# EAGLE design surplus_relay_hat_v2 (EAGLE 8.0.2)
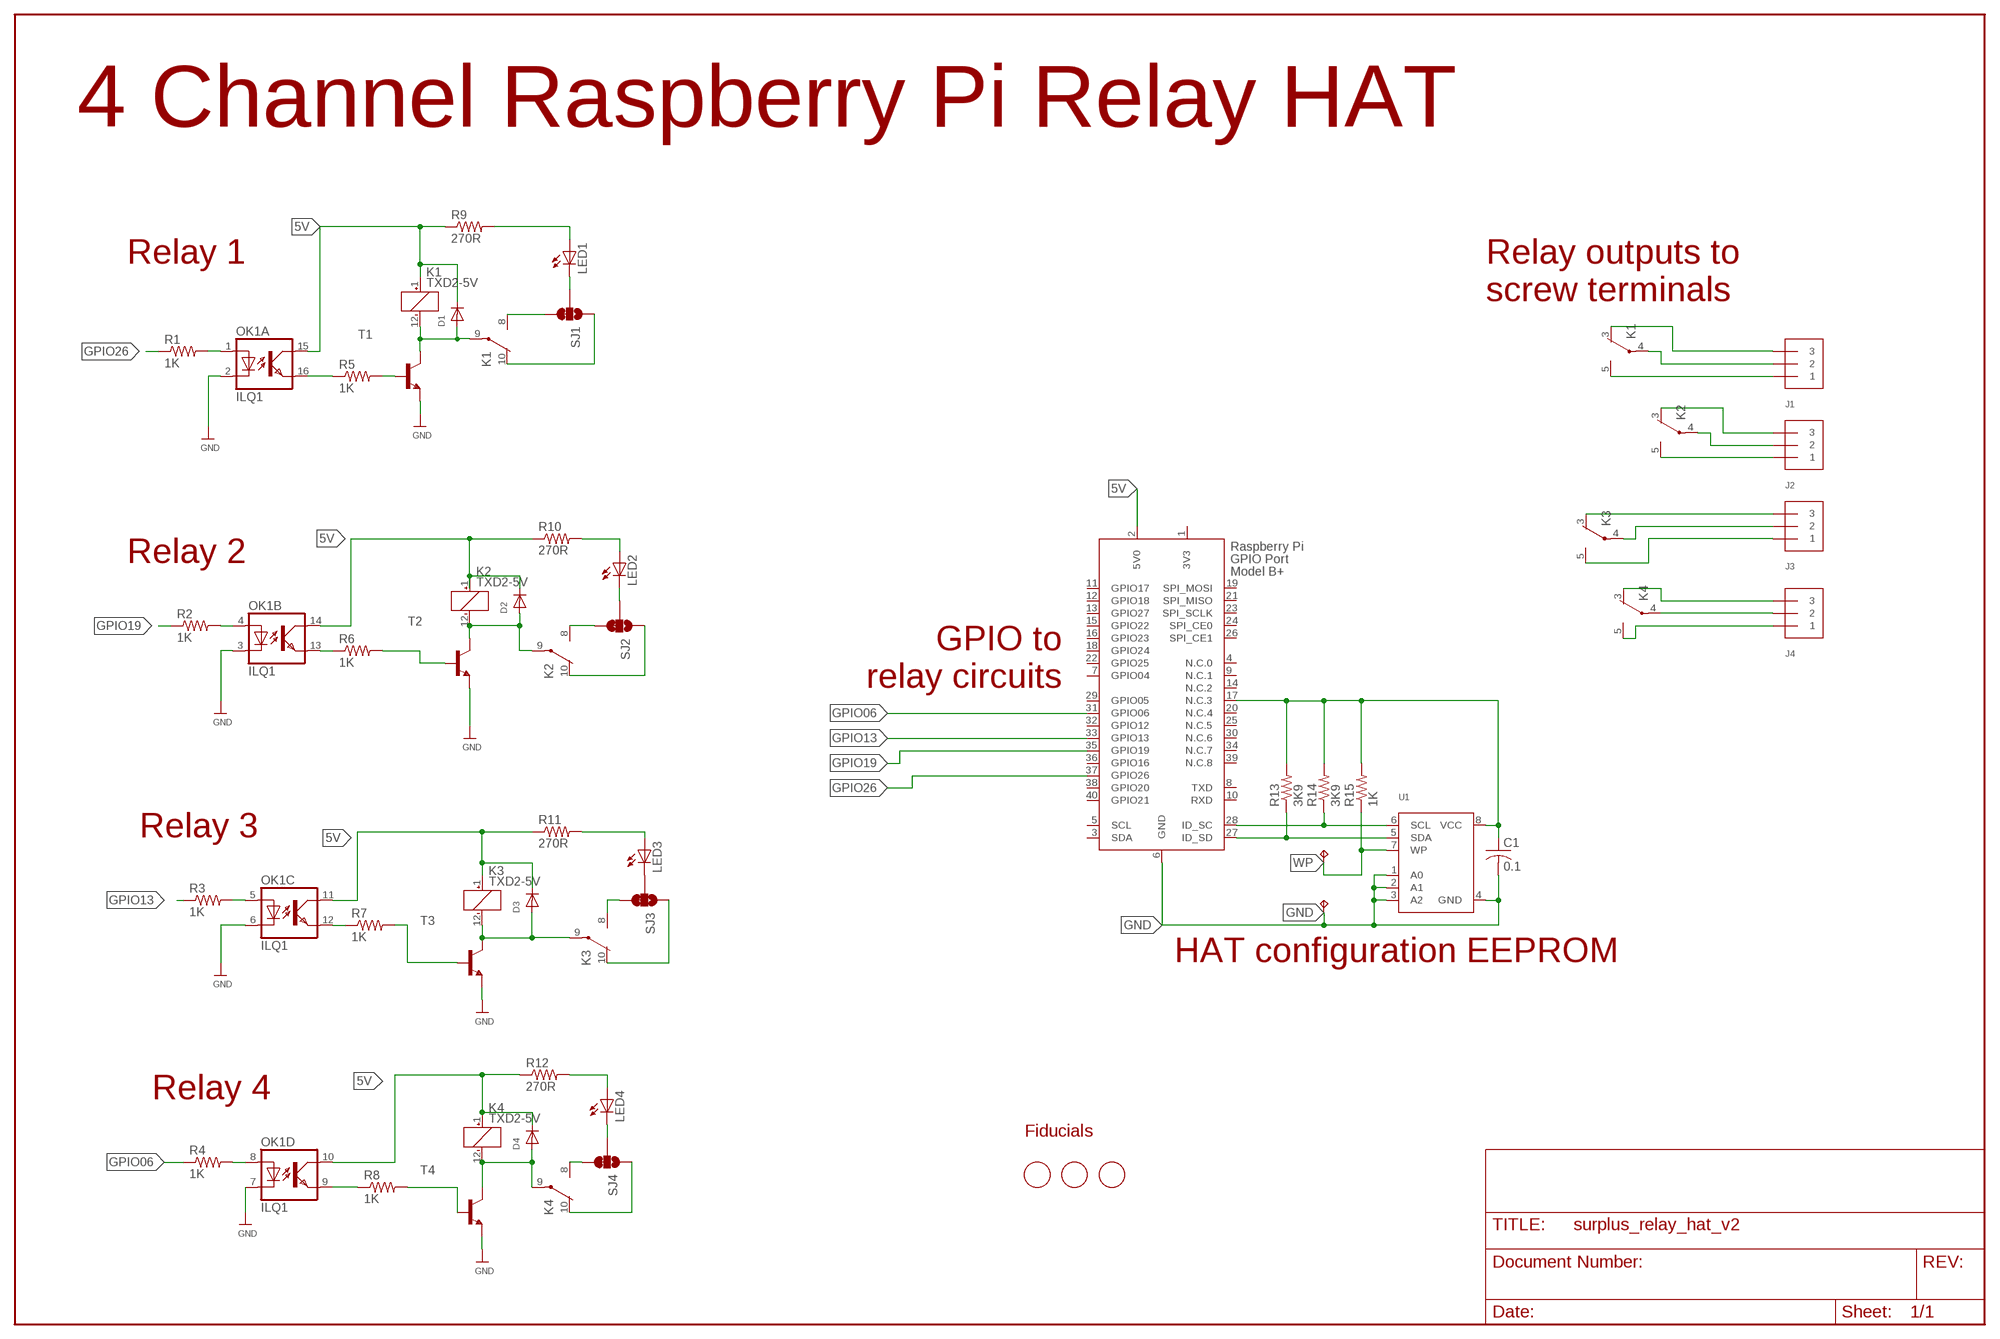
[diagram p0: schematic, sheet 1]

## Parts
C1  0.1  C-USC0805K  [C0805K]
CFG  TPTP11R  [TP11R]
D1  DIODE_SOD-123FL  [SOD-123FL]
D2  DIODE_SOD-123FL  [SOD-123FL]
D3  DIODE_SOD-123FL  [SOD-123FL]
D4  DIODE_SOD-123FL  [SOD-123FL]
GND  TPTP11R  [TP11R]
J1  TERMBLOCK_1X3  [TERMBLOCK_1X3-3.5MM]
J2  TERMBLOCK_1X3  [TERMBLOCK_1X3-3.5MM]
J3  TERMBLOCK_1X3  [TERMBLOCK_1X3-3.5MM]
J4  TERMBLOCK_1X3  [TERMBLOCK_1X3-3.5MM]
K1  TXD2-5V  [TXD2]
K2  TXD2-5V  [TXD2]
K3  TXD2-5V  [TXD2]
K4  TXD2-5V  [TXD2]
LED1  LEDCHIP-LED0805  [CHIP-LED0805]
LED2  LEDCHIP-LED0805  [CHIP-LED0805]
LED3  LEDCHIP-LED0805  [CHIP-LED0805]
LED4  LEDCHIP-LED0805  [CHIP-LED0805]
OK1  ILQ1  [DIL16]
R1  1K  R-US_R0603  [R0603]
R2  1K  R-US_R0603  [R0603]
R3  1K  R-US_R0603  [R0603]
R4  1K  R-US_R0603  [R0603]
R5  1K  R-US_R0603  [R0603]
R6  1K  R-US_R0603  [R0603]
R7  1K  R-US_R0603  [R0603]
R8  1K  R-US_R0603  [R0603]
R9  270R  R-US_R0603  [R0603]
R10  270R  R-US_R0603  [R0603]
R11  270R  R-US_R0603  [R0603]
R12  270R  R-US_R0603  [R0603]
R13  3K9  R-US_R0603  [R0603]
R14  3K9  R-US_R0603  [R0603]
R15  1K  R-US_R0603  [R0603]
SJ1  JUMPER-PAD-3-2OF3_NC_BY_TRACE  [PAD-JUMPER-3-2OF3_NC_BY_TRACE_YES_SILK_FULL_BOX]
SJ2  JUMPER-PAD-3-2OF3_NC_BY_TRACE  [PAD-JUMPER-3-2OF3_NC_BY_TRACE_YES_SILK_FULL_BOX]
SJ3  JUMPER-PAD-3-2OF3_NC_BY_TRACE  [PAD-JUMPER-3-2OF3_NC_BY_TRACE_YES_SILK_FULL_BOX]
SJ4  JUMPER-PAD-3-2OF3_NC_BY_TRACE  [PAD-JUMPER-3-2OF3_NC_BY_TRACE_YES_SILK_FULL_BOX]
T1  MMBT2222ALT1-NPN-SOT23-BEC  [SOT23-BEC]
T2  MMBT2222ALT1-NPN-SOT23-BEC  [SOT23-BEC]
T3  MMBT2222ALT1-NPN-SOT23-BEC  [SOT23-BEC]
T4  MMBT2222ALT1-NPN-SOT23-BEC  [SOT23-BEC]
U1  EEPROM_I2C_SOIC8_GENERIC  [SOIC8_150MIL]
U$2  FIDUCIAL  [FIDUCIAL_1MM]
U$12  FIDUCIAL  [FIDUCIAL_1MM]
U$13  FIDUCIAL  [FIDUCIAL_1MM]
X1  RASPI_BOARD_B+_H  [RASPI_BOARD_B+HAT]

## Nets
5V: D1.C D2.C D3.C D4.C K1.1(_:+) K2.1(_:+) K3.1(_:+) K4.1(_:+) OK1.10(D:COL) OK1.11(C:COL) OK1.14(B:COL) OK1.15(A:COL) R9.1 R10.1 R11.1 R12.1 X1.2(5V0)
GND: C1.2 GND.TP OK1.2(A:C) OK1.3(B:C) OK1.6(C:C) OK1.7(D:C) T1.E T2.E T3.E T4.E U1.1(A0) U1.2(A1) U1.3(A2) U1.4(GND) X1.6(GND)
GPIO06: R4.1 X1.31(GPIO06)
GPIO13: R3.1 X1.33(GPIO13)
GPIO19: R2.1 X1.35(GPIO19)
GPIO26: R1.1 X1.37(GPIO26)
ID-SCL: R14.1 U1.6(SCL) X1.28(ID_SC)
ID-SDA: R13.1 U1.5(SDA) X1.27(ID_SD)
N$1: R5.2 T1.B
N$2: OK1.16(A:EMIT) R5.1
N$3: OK1.1(A:A) R1.2
N$4: D1.A K1.9(P) K1.12(_:-) T1.C
N$5: J1.2 K1.4(P)
N$6: J1.1 K1.5(S)
N$7: J1.3 K1.3(O)
N$8: J2.1 K2.5(S)
N$9: OK1.4(B:A) R2.2
N$10: D2.A K2.9(P) K2.12(_:-) T2.C
N$11: R6.2 T2.B
N$12: J2.2 K2.4(P)
N$13: OK1.12(C:EMIT) R7.1
N$14: J2.3 K2.3(O)
N$15: OK1.5(C:A) R3.2
N$16: OK1.8(D:A) R4.2
N$17: D4.A K4.9(P) K4.12(_:-) T4.C
N$18: R7.2 T3.B
N$19: OK1.9(D:EMIT) R8.1
N$20: LED1.C SJ1.2
N$21: J3.2 K3.4(P)
N$22: J3.1 K3.5(S)
N$23: J3.3 K3.3(O)
N$24: R8.2 T4.B
N$25: K1.8(S) SJ1.3
N$26: J4.1 K4.5(S)
N$27: J4.2 K4.4(P)
N$28: J4.3 K4.3(O)
N$29: LED1.A R9.2
N$30: K1.10(O) SJ1.1
N$32: K4.10(O) SJ4.1
N$33: LED4.A R12.2
N$34: LED3.A R11.2
N$35: K4.8(S) SJ4.3
N$36: LED4.C SJ4.2
N$37: LED2.A R10.2
N$39: C1.1 R13.2 R14.2 R15.2 U1.8(VCC) X1.17(N.C.3)
N$40: OK1.13(B:EMIT) R6.1
N$42: D3.A K3.9(P) K3.12(_:-) T3.C
N$43: K3.8(S) SJ3.3
N$44: K3.10(O) SJ3.1
N$45: LED3.C SJ3.2
N$46: LED2.C SJ2.2
N$47: K2.8(S) SJ2.3
N$48: K2.10(O) SJ2.1
WP: CFG.TP R15.1 U1.7(WP)
Unconnected: X1.3(SDA) X1.4(N.C.0) X1.5(SCL) X1.7(GPIO04) X1.8(TXD) X1.10(RXD) X1.11(GPIO17) X1.12(GPIO18) X1.13(GPIO27) X1.14(N.C.2) X1.15(GPIO22) X1.16(GPIO23) X1.18(GPIO24) X1.19(SPI_MOSI) X1.20(N.C.4) X1.21(SPI_MISO) X1.22(GPIO25) X1.23(SPI_SCLK) X1.24(SPI_CE0) X1.25(N.C.5) X1.26(SPI_CE1) X1.29(GPIO05) X1.30(N.C.6) X1.32(GPIO12) X1.34(N.C.7) X1.36(GPIO16) X1.38(GPIO20) X1.39(N.C.8) X1.40(GPIO21)

## Notes on the sheet
- 4 Channel Raspberry Pi Relay HAT
- Relay 1
- Relay outputs to
  screw terminals
- Relay 2
- GPIO to
  relay circuits
- Relay 3
- HAT configuration EEPROM
- Relay 4
- Fiducials

## Power pins joined to a net without a drawn wire
3V3: X1.1(3V3)
N.C.1: X1.9(N.C.1)

## Library data of the parts
C1 = adafruit:C-US: CAPACITOR, American symbol
CFG GND = testpad:TP: Test pad
D1-D4 = adafruit:DIODE: Diode SMADIODE - SMA Surface Mount Package 20V 1A Schottky Diode Digikey: 641-1014-6-ND DO-1N4148 - Through Hole Small Current Diode SOD-123 20V 1 A (.5mV Vf) Schottky Diode - Digikey: MBRX120TPMSCT-ND SOD-323 10V 570mA (.38mV Vf, 3ns) Schottky Diode - Digikey: ZLLS410CT-ND SOD-523 30V 30mA Schottky Diode (RB751S-40TE61) - Digikey: RB751S-40TE61CT-ND SOT23-R/W - SOT23 Package (R = Solder Paste/Reflow Ovens, W = Hand-Soldering) BAT54Film 40V 300mA - Digikey: 497-7162-1-ND
J1-J4 = TL2575:TERMBLOCK_1X3: 3.5mm Terminal block http://www.ladyada.net/library/pcb/eaglelibrary.html
K1-K4 = relay:TX?-*: TX Relais NAiS TX-D RELAYS HIGH INSULATION Conforming to the supplementary insulation class of EN Standards (EN41003) Source: http://www.mew-europe.com/.. en_ds_61022_0007.pdf TX-S RELAYS SMALL POLARIZED RELAY WITH HIGH SENSITIVITY 50mW Source: http://www.mew-europe.com/.. en_ds_61022_0022.pdf; MPN: TXD2-5V; OC_FARNELL: unknown; OC_NEWARK: 13P9525
LED1-LED4 = adafruit:LED: LED OSRAM: - CHIPLED LG R971, LG N971, LY N971, LG Q971, LY Q971, LO R971, LY R971 LH N974, LH R974 LS Q976, LO Q976, LY Q976 LO Q996 - Hyper CHIPLED LW Q18S LB Q993, LB Q99A, LB R99A - SideLED LS A670, LO A670, LY A670, LG A670, LP A670 LB A673, LV A673, LT A673, LW A673 LH A674 LY A675 LS A676, LA A676, LO A676, LY A676, LW A676 LS A679, LY A679, LG A679 - Hyper Micro SIDELED® LS Y876, LA Y876, LO Y876, LY Y876 LT Y87S - SmartLED LW L88C, LW L88S LB L89C, LB L89S, LG L890 LS L89K, LO L89K, LY L89K LS L896, LA L896, LO L896, LY L896 - TOPLED LS T670, LO T670, LY T670, LG T670, LP T670 LSG T670, LSP T670, LSY T670, LOP T670, LYG T670 LG T671, LOG T671, LSG T671 LB T673, LV T673, LT T673, LW T673 LH T674 LS T676, LA T676, LO T676, LY T676, LB T676, LH T676, LSB T676, LW T676 LB T67C, LV T67C, LT T67C, LS T67K, LO T67K, LY T67K, LW E67C LS E67B, LA E67B, LO E67B, LY E67B, LB E67C, LV E67C, LT E67C LW T67C LS T679, LY T679, LG T679 LS T770, LO T770, LY T770, LG T770, LP T770 LB T773, LV T773, LT T773, LW T773 LH T774 LS E675, LA E675, LY E675, LS T675 LS T776, LA T776, LO T776, LY T776, LB T776 LHGB T686 LT T68C, LB T68C - Hyper Mini TOPLED® LB M676 - Mini TOPLED Santana® LG M470 LS M47K, LO M47K, LY M47K Source: http://www.osram.convergy.de/
OK1 = optocoupler:ILQ1: SIEMENS OPTO COUPLER; MF: VISHAY/TELEFUNKEN; MPN: ILQ1; OC_FARNELL: 1469501; OC_NEWARK: 88K1954
R1-R15 = adafruit:R-US_: RESISTOR, American symbol
SJ1-SJ4 = SparkFun-Passives:JUMPER-PAD-3-2OF3_NC_BY_TRACE
T1-T4 = transistor:*-NPN-: NPN Transistror BF959 corrected 2008.03.06
U1 = microbuilder:EEPROM_I2C_SOIC8_GENERIC
U$2 U$12 U$13 = adafruit:FIDUCIAL
X1 = raspberrypi_bastelstube_v13:RASPI_BOARD_B+

## Board
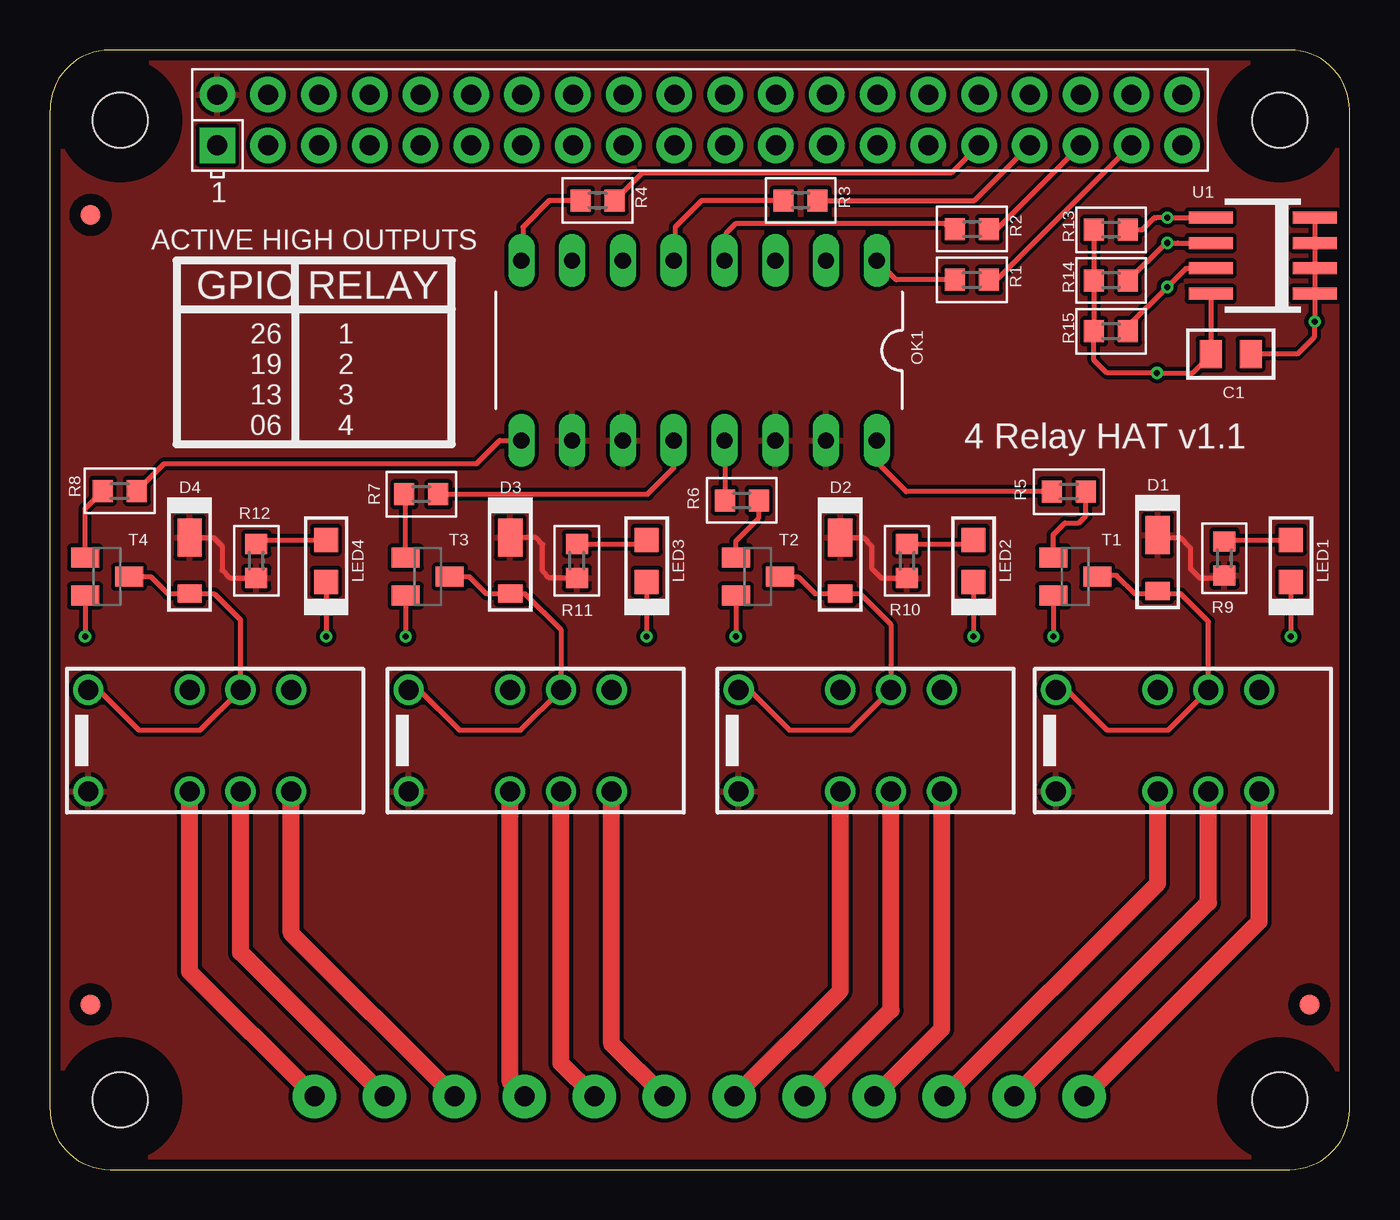
[diagram p1: board, top side]
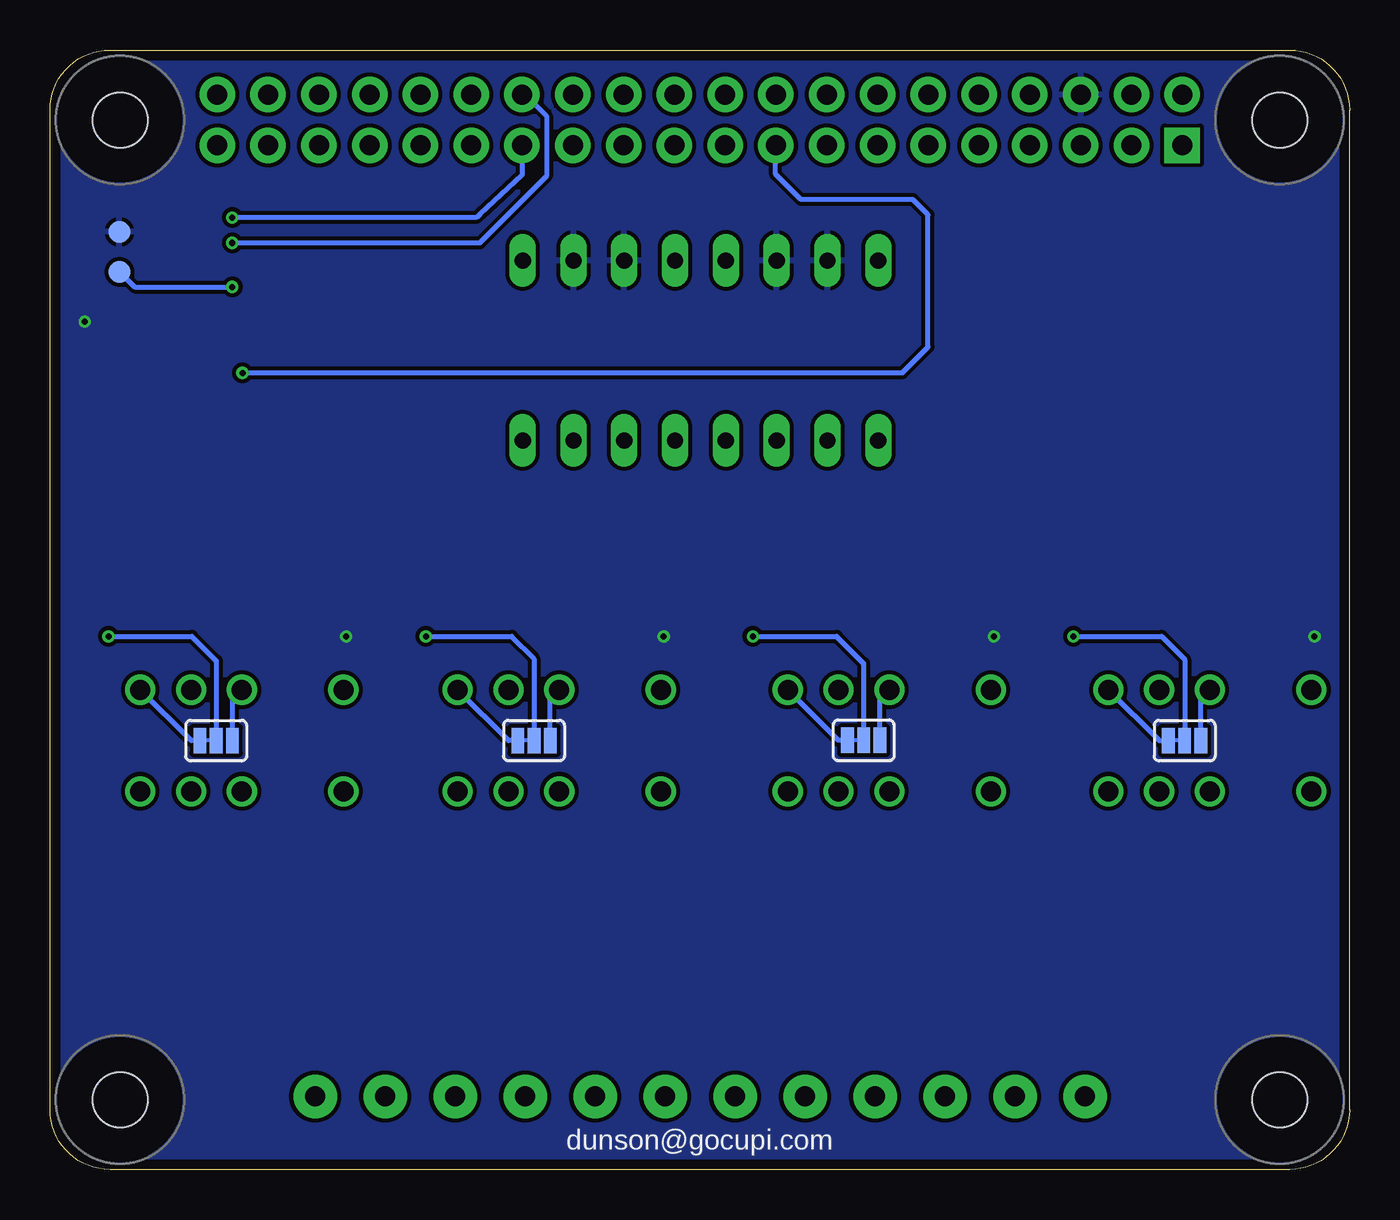
[diagram p2: board, bottom side, seen from below]

Size 65 x 56 mm. Coordinates in mm from the lower left corner, seen from the top.
Copper layers (1*16): Top 0.035mm / dielectric 1.5mm / Bottom 0.035mm
Design rules "dirt_cheap_dirty_boards.v1 *": minimum track width 5mil, minimum drill 12mil, track to track 8mil, track to pad 8mil, pad to pad 8mil, via to via 8mil, smd to smd 8mil, copper to edge 20mil, drill to drill 12mil, minimum pad ring 10mil, minimum via ring 6mil, stop-mask expansion 2mil, vias tented up to drill 25mil, thermal gap 8mil
tRestrict: area 0.4,0.4 to 6.6,6.6; area 58.4,0.4 to 64.6,6.6; area 0.4,49.4 to 6.6,55.6; area 58.4,49.4 to 64.6,55.6
bRestrict: area 0.4,0.4 to 6.6,6.6; area 58.4,0.4 to 64.6,6.6; area 0.4,49.4 to 6.6,55.6; area 58.4,49.4 to 64.6,55.6

### Footprints (pad centres in the part's own frame; a part is rotated, then mirrored left to right if it is on the bottom)
C0805K = smd 1.1 x 1.4: 1 -1,0; 2 1,0
TP11R = smd 1.1 x 1.1: TP 0,0
SOD-123FL = smd 0.91 x 1.22: A 1.637,0 | smd 1.91 x 1.22: C -1.161,0
TERMBLOCK_1X3-3.5MM = drill 1 pad 2.184: 1 3.55,0; 2 0.05,0; 3 -3.45,0
TXD2 = drill 1: 1 -6.35,-2.54; 3 -1.27,-2.54; 4 1.27,-2.54; 5 3.81,-2.54; 8 3.81,2.54; 9 1.27,2.54; 10 -1.27,2.54; 12 -6.35,2.54
CHIP-LED0805 = smd 1.2 x 1.2: A 0,-1.05; C 0,1.05
DIL16 = drill 0.813 long: 1 -8.89,-4.5; 2 -6.35,-4.5; 3 -3.81,-4.5; 4 -1.27,-4.5; 5 1.27,-4.5; 6 3.81,-4.5; 7 6.35,-4.5; 8 8.89,-4.5; 9 8.89,4.5; 10 6.35,4.5; 11 3.81,4.5; 12 1.27,4.5; 13 -1.27,4.5; 14 -3.81,4.5; 15 -6.35,4.5; 16 -8.89,4.5
R0603 = smd 1 x 1.1: 1 -0.85,0; 2 0.85,0
PAD-JUMPER-3-2OF3_NC_BY_TRACE_YES_SILK_FULL_BOX = smd 0.635 x 1.27: 1 -0.813,0; 2 0,0; 3 0.813,0
SOT23-BEC = smd 1 x 1.4: B -0.95,-1.1; C 0,1.1; E 0.95,-1.1
SOIC8_150MIL = smd 0.6 x 2.2: 1 -1.905,-2.6; 2 -0.635,-2.6; 3 0.635,-2.6; 4 1.905,-2.6; 5 1.905,2.6; 6 0.635,2.6; 7 -0.635,2.6; 8 -1.905,2.6
FIDUCIAL_1MM = smd 1 x 1: 1 0,0
RASPI_BOARD_B+HAT = drill 1 pad 1.778 square: 1 8.37,51.23 | drill 1 pad 1.778: 2 8.37,53.77; 3 10.91,51.23; 4 10.91,53.77; 5 13.45,51.23; 6 13.45,53.77; 7 15.99,51.23; 8 15.99,53.77; 9 18.53,51.23; 10 18.53,53.77; 11 21.07,51.23; 12 21.07,53.77; 13 23.61,51.23; 14 23.61,53.77; 15 26.15,51.23; 16 26.15,53.77; 17 28.69,51.23; 18 28.69,53.77; 19 31.23,51.23; 20 31.23,53.77; 21 33.77,51.23; 22 33.77,53.77; 23 36.31,51.23; 24 36.31,53.77; 25 38.85,51.23; 26 38.85,53.77; 27 41.39,51.23; 28 41.39,53.77; 29 43.93,51.23; 30 43.93,53.77; 31 46.47,51.23; 32 46.47,53.77; 33 49.01,51.23; 34 49.01,53.77; 35 51.55,51.23; 36 51.55,53.77; 37 54.09,51.23; 38 54.09,53.77; 39 56.63,51.23; 40 56.63,53.77 | hole 2.75: 3.5,3.5; 3.5,52.5; 61.5,3.5; 61.5,52.5

### Placement (x,y rotation side)
C1  59.05,40.79 0 top
CFG  61.53,44.91 270 bottom
D1  55.4,30.57 270 top
D2  39.53,30.45 270 top
D3  23.02,30.45 270 top
D4  6.99,30.45 270 top
GND  61.53,46.91 270 bottom
J1  48.18,3.65 0 top
J2  37.68,3.65 0 top
J3  27.18,3.65 0 top
J4  16.68,3.65 0 top
K1  56.67,21.46 0 top
K2  40.8,21.46 0 top
K3  24.29,21.46 0 top
K4  8.26,21.46 0 top
LED1  62.07,30.45 180 top
LED2  46.2,30.45 180 top
LED3  29.84,30.45 180 top
LED4  13.81,30.45 180 top
OK1  32.47,40.97 180 top
R1  46.11,44.5 180 top
R2  46.12,47.04 180 top
R3  37.55,48.47 180 top
R4  27.39,48.47 180 top
R5  50.96,33.91 0 top
R6  34.6,33.46 0 top
R7  18.57,33.78 180 top
R8  3.49,33.94 180 top
R9  58.74,30.57 90 top
R10  42.86,30.45 90 top
R11  26.35,30.45 90 top
R12  10.32,30.45 90 top
R13  53.07,47.01 180 top
R14  53.07,44.47 180 top
R15  53.07,41.93 180 top
SJ1  56.69,21.45 180 bottom
SJ2  40.79,21.46 180 bottom
SJ3  24.3,21.47 180 bottom
SJ4  8.25,21.45 180 bottom
T1  51.28,29.65 270 top
T2  35.4,29.65 270 top
T3  18.89,29.65 270 top
T4  2.86,29.65 270 top
U1  60.66,45.71 90 top
U$2  2.03,8.26 0 top
U$12  62.99,8.26 0 top
U$13  2.03,47.75 0 top
X1  0,0 0 top

### Tracks (layer width: path | path; a pad name or v marks a point on that pad's centre or on a via)
5V
  Top 0.254: R11.1 24.97,29.6 24.64,29.93 24.64,31.27 24.31,31.6 D3.C | D4.C 8.2,31.61 8.61,31.2 8.61,29.98 8.99,29.6 R12.1 | D2.C 40.69,31.61 41.1,31.2 41.1,30.08 41.58,29.6 R10.1 | R9.1 58.74,29.6 57.51,29.6 57.05,30.05 57.05,31.1 56.53,31.61 55.53,31.61 D1.C
  pour Top: 2.54,0 62.39,0 arc90 64.93,2.54 65,53 arc90 62,56.01 3.02,56.01 arc90 0.02,53.01 0,2.54 arc90
GND  (via drill 0.3)
  Top 0.254: T4.E 1.76,28.66 v1.75,26.67 | T3.E 17.79,28.66 v17.79,26.67 | T2.E v34.3,26.67 | T1.E 50.19,28.73 v50.19,26.67 | C1.2 62.38,40.79 63.26,41.66 v63.26,42.42 U1.1 U1.2 U1.3 U1.4 63.18,47.69
  pour Bottom: 2.54,0 62.39,0 arc90 64.93,2.54 65,53.01 arc90 62,56.01 3.03,56.01 arc90 0.03,53.01 0,2.54 arc90
GPIO06
  Top 0.254: X1.31 45.09,49.85 29.62,49.85 R4.1
GPIO13
  Top 0.254: X1.33 46.25,48.47 R3.1
GPIO19
  Top 0.254: R2.1 47.36,47.04 X1.35
GPIO26
  Top 0.254: R1.1 47.36,44.5 X1.37
ID-SCL  (via drill 0.3)
  Top 0.254: U1.6 56.39,46.35 v55.88,46.35 55.8,46.35 R14.1
  Bottom 0.254: X1.28 41.23,53.77 40.16,52.7 40.16,49.69 43.5,46.35 v55.88,46.35
ID-SDA  (via drill 0.3)
  Top 0.254: 58.22,47.78 U1.5 v55.88,47.62 55.37,47.62 55.24,47.62 54.63,47.01 R13.1
  Bottom 0.254: X1.27 41.39,49.73 43.5,47.78 43.66,47.62 v55.88,47.62
N$1
  Top 0.254: T1.B 50.19,31.75 50.77,32.34 51.46,32.34 51.82,32.7 51.82,33.77 R5.2
N$2
  Top 0.254: R5.1 42.83,33.91 41.35,35.39 OK1.16
N$3
  Top 0.254: R1.2 42.32,44.5 OK1.1
N$4
  Top 0.254: T1.C arc-90 52.45,29.72 53.34,29.72 54.25,28.81 55.4,28.81 D1.A 55.53,28.81 56.54,28.81 57.94,27.41 K1.9 55.93,21.99 52.86,21.99 50.85,24 K1.12
N$5
  Top 0.84: J1.2 57.94,13.36 K1.4
N$6
  Top 0.84: J1.1 60.48,12.4 K1.5
N$7
  Top 0.84: J1.3 55.4,14.32 K1.3
N$8
  Top 0.84: J2.1 44.61,7.03 K2.5
N$9
  Top 0.254: R2.2 45.03,47.04 44.77,47.31 34.29,47.31 33.81,46.83 33.81,45.55 OK1.4
N$10
  Top 0.254: T2.C 37.41,29.65 38.25,28.81 D2.A 40.51,28.81 42.06,27.26 K2.9 40.06,21.99 36.99,21.99 34.98,24 K2.12
N$11
  Top 0.254: T2.B 34.3,31.44 35.46,32.59 35.46,33.14 R6.2
N$12
  Top 0.84: J2.2 42.07,7.99 K2.4
N$13
  Top 0.254: R7.1 29.89,33.78 31.19,35.08 31.19,36.36 OK1.12
N$14
  Top 0.84: J2.3 39.53,8.95 K2.3
N$15
  Top 0.254: R3.2 32.59,48.47 31.27,47.15 31.27,45.55 OK1.5
N$16
  Top 0.254: R4.2 24.98,48.47 23.65,47.15 23.65,45.55 OK1.8
N$17
  Top 0.254: T4.C 5.05,29.65 5.89,28.81 D4.A 8.2,28.81 9.53,27.49 K4.9 7.51,21.99 4.45,21.99 2.43,24 K4.12
N$18
  Top 0.254: T3.B 17.79,33.71 R7.2
N$19
  Top 0.254: R8.1 5.71,35.31 21.34,35.31 22.5,36.47 OK1.9
N$20  (via drill 0.3)
  Top 0.254: LED1.C v62.07,26.67
  Bottom 0.254: SJ1.2 | 56.67,21.46 SJ1.2 | v62.07,26.67 57.91,26.67 56.69,25.44 SJ1.2
N$21
  Top 0.84: J3.2 25.56,5.33 K3.4
N$22
  Top 0.84: J3.1 28.1,6.29 K3.5
N$23
  Top 0.84: J3.3 23.02,4.37 K3.3
N$24
  Top 0.254: T4.B 1.76,33.06 R8.2
N$25
  Bottom 0.254: SJ1.3 57.94,21.45 K1.8
N$26
  Top 0.84: J4.1 12.06,11.82 K4.5
N$27
  Top 0.84: J4.2 9.53,10.86 K4.4
N$28
  Top 0.84: J4.3 6.99,9.9 K4.3
N$29
  Top 0.254: R9.2 58.81,31.5 LED1.A
N$30
  Bottom 0.254: SJ1.1 55.87,23.53 K1.10
N$32
  Bottom 0.254: SJ4.1 7.44,23.55 K4.10
N$33
  Top 0.254: R12.2 10.52,31.5 LED4.A
N$34
  Top 0.254: R11.2 29.64,31.3 LED3.A
N$35
  Bottom 0.254: SJ4.3 9.52,21.45 K4.8
N$36  (via drill 0.3)
  Top 0.254: LED4.C v13.81,26.67
  Bottom 0.254: SJ4.2 | SJ4.2 | v13.81,26.67 9.4,26.67 8.25,25.52 SJ4.2
N$37
  Top 0.254: R10.2 46,31.3 LED2.A
N$39  (via drill 0.3)
  Top 0.254: R13.2 R14.2 R15.2 52.22,40.49 52.86,39.85 v55.37,39.85 57.15,39.85 58.1,40.79 C1.1 U1.8
  Bottom 0.254: v55.37,39.85 22.38,39.85 21.08,41.15 21.08,47.75 21.84,48.51 27.43,48.51 28.7,49.78 28.7,51.22 X1.17
N$40
  Top 0.254: OK1.13 33.75,36.45 R6.1
N$42
  Top 0.254: T3.C 20.97,29.65 21.82,28.81 D3.A 23.75,28.81 25.55,27.01 25.55,24.82 K3.9 23.55,21.99 20.48,21.99 18.47,24 K3.12
N$43
  Bottom 0.254: SJ3.3 25.57,21.46 K3.8
N$44
  Bottom 0.254: SJ3.1 23.49,23.53 K3.10
N$45  (via drill 0.3)
  Top 0.254: LED3.C v29.84,26.67
  Bottom 0.254: SJ3.2 24.31,21.46 | SJ3.2 | v29.84,26.67 25.65,26.67 24.3,25.32 SJ3.2
N$46  (via drill 0.3)
  Top 0.254: LED2.C v46.2,26.67
  Bottom 0.254: SJ2.2 40.79,25.55 41.91,26.67 v46.2,26.67
N$47
  Bottom 0.254: SJ2.3 42.07,21.46 K2.8
N$48
  Bottom 0.254: SJ2.1 39.98,23.55 K2.10
WP  (via drill 0.3)
  Top 0.254: R15.1 53.92,42.18 55.91,44.16 | 55.91,44.16 56.83,45.09 58.05,45.09 U1.7 | v55.88,44.15 55.9,44.16 55.91,44.16
  Bottom 0.254: CFG.TP 60.76,44.15 v55.88,44.15

### Text on the board
tPlace: ACTIVE HIGH OUTPUTS | GPIO RELAY | 26 1 / 19 2 / 13 3 / 06 4 | 4 Relay HAT v1.1
bPlace: dunson@gocupi.com